# Altium schematic sheet 05_Encoder_IN.SchDoc: -
size A4; Date: -; ApprovedBy: -; CheckedBy: -; Author: -; CompanyName: -; DrawnBy: -; Engineer: -; Organization: Komax AG; Address1: -; Address2: -; Address3: -; Address4: -; DocumentNumber: -; Revision: -; SheetNumber: 5; SheetTotal: 8; KSDP_ObjectName: Encoder IN; KSDP_CreatedBy: Patrick Rossacher; KSDP_CreationDate: 18.12.2017; KSDP_ModificationDate: -; KSDP_ModifiedBy: -; CurrentTime: -; CurrentDate: -; Time: -; DocumentFullPathAndName: -; DocumentName: -; ModifiedDate: -; ImagePath: -
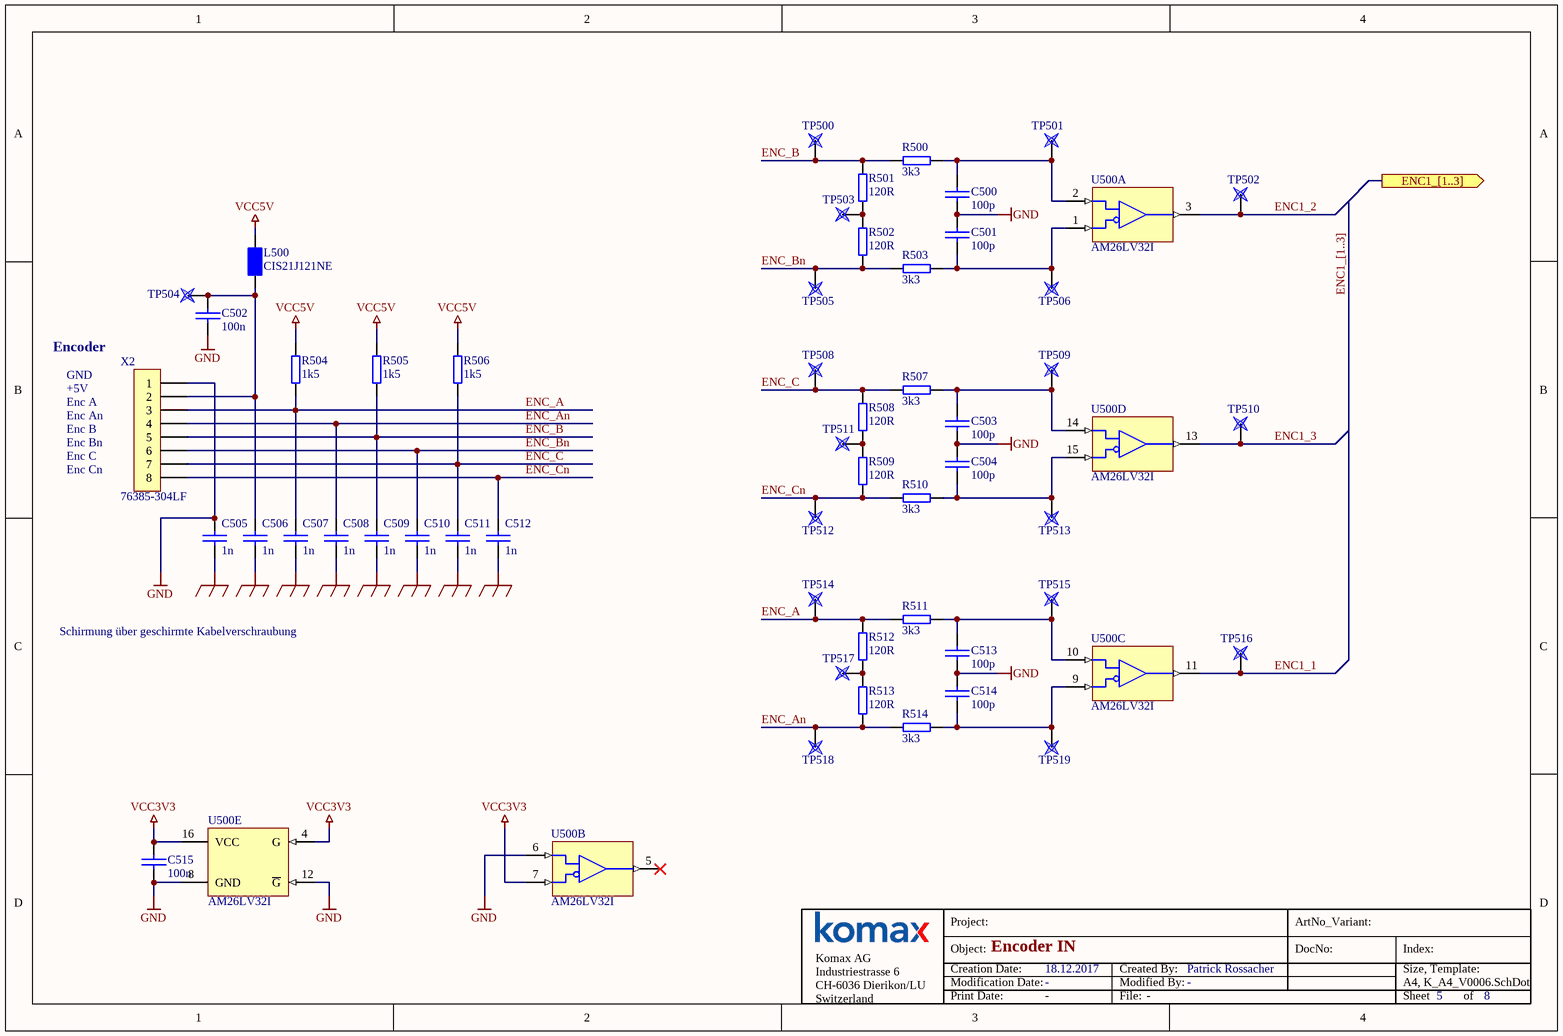
[diagram p0: 05_Encoder_IN.SchDoc]

## Parts
C500  100p  [0402_c]
C501  100p  [0402_c]
C502  100n  [0402_c]
C503  100p  [0402_c]
C504  100p  [0402_c]
C505  1n  [0402_c]
C506  1n  [0402_c]
C507  1n  [0402_c]
C508  1n  [0402_c]
C509  1n  [0402_c]
C510  1n  [0402_c]
C511  1n  [0402_c]
C512  1n  [0402_c]
C513  100p  [0402_c]
C514  100p  [0402_c]
C515  100n  [0402_c]
L500  CIS21J121NE  [0805_R]
R500  3k3  [0402_R]
R501  120R  [0603_R]
R502  120R  [0603_R]
R503  3k3  [0402_R]
R504  1k5  [0402_R]
R505  1k5  [0402_R]
R506  1k5  [0402_R]
R507  3k3  [0402_R]
R508  120R  [0603_R]
R509  120R  [0603_R]
R510  3k3  [0402_R]
R511  3k3  [0402_R]
R512  120R  [0603_R]
R513  120R  [0603_R]
R514  3k3  [0402_R]
TP500  TESTPUNKT  [TP1.5MM]  (value not drawn)  (no BOM)
TP501  TESTPUNKT  [TP1.5MM]  (value not drawn)  (no BOM)
TP502  TESTPUNKT  [TP1.5MM]  (value not drawn)  (no BOM)
TP503  TESTPUNKT  [TP1.5MM]  (value not drawn)  (no BOM)
TP504  TESTPUNKT  [TP1.5MM]  (value not drawn)  (no BOM)
TP505  TESTPUNKT  [TP1.5MM]  (value not drawn)  (no BOM)
TP506  TESTPUNKT  [TP1.5MM]  (value not drawn)  (no BOM)
TP508  TESTPUNKT  [TP1.5MM]  (value not drawn)  (no BOM)
TP509  TESTPUNKT  [TP1.5MM]  (value not drawn)  (no BOM)
TP510  TESTPUNKT  [TP1.5MM]  (value not drawn)  (no BOM)
TP511  TESTPUNKT  [TP1.5MM]  (value not drawn)  (no BOM)
TP512  TESTPUNKT  [TP1.5MM]  (value not drawn)  (no BOM)
TP513  TESTPUNKT  [TP1.5MM]  (value not drawn)  (no BOM)
TP514  TESTPUNKT  [TP1.5MM]  (value not drawn)  (no BOM)
TP515  TESTPUNKT  [TP1.5MM]  (value not drawn)  (no BOM)
TP516  TESTPUNKT  [TP1.5MM]  (value not drawn)  (no BOM)
TP517  TESTPUNKT  [TP1.5MM]  (value not drawn)  (no BOM)
TP518  TESTPUNKT  [TP1.5MM]  (value not drawn)  (no BOM)
TP519  TESTPUNKT  [TP1.5MM]  (value not drawn)  (no BOM)
U500  AM26LV32I  [SOIC-16]  (parts A,B,C,D,E of 5)
X2  76385-304LF  [CON_THT_FCI_76_385-304-LF]

## Ports
ENC1_[1..3] (out)

## Nets
GND: C500.2 C501.2 C502.1 C503.2 C504.2 C505.1 C513.2 C514.2 C515.2 U500.6(A2) U500.8(GND) U500.12(~{G}) X2.1
Shield_2: C505.2 C506.2 C507.2 C508.2 C509.2 C510.2 C511.2 C512.2
VCC3V3: C515.1 U500.4(G) U500.7(B2) U500.16(VCC)
VCC5V: L500.1 R504.1 R505.2 R506.2
ENC1_1: TP516.1 U500.11(Y3)
ENC1_2: TP502.1 U500.3(Y1)
ENC1_3: TP510.1 U500.13(Y4)
ENC_A: C507.1 R504.2 R511.2 R512.1 TP514.1 X2.3
ENC_An: C508.1 R513.2 R514.2 TP518.1 X2.4
ENC_B: C509.1 R500.2 R501.1 R505.1 TP500.1 X2.5
ENC_Bn: C510.1 R502.2 R503.2 TP505.1 X2.6
ENC_C: C511.1 R506.1 R507.2 R508.1 TP508.1 X2.7
ENC_Cn: C512.1 R509.2 R510.2 TP512.1 X2.8
NetC500_1: C500.1 R500.1 TP501.1 U500.2(A1)
NetC501_1: C501.1 R503.1 TP506.1 U500.1(B1)
NetC502_2: C502.2 C506.1 L500.2 TP504.1 X2.2
NetC503_1: C503.1 R507.1 TP509.1 U500.14(A4)
NetC504_1: C504.1 R510.1 TP513.1 U500.15(B4)
NetC513_1: C513.1 R511.1 TP515.1 U500.10(A3)
NetC514_1: C514.1 R514.1 TP519.1 U500.9(B3)
NetR501_2: R501.2 R502.1 TP503.1
NetR508_2: R508.2 R509.1 TP511.1
NetR512_2: R512.2 R513.1 TP517.1

Not connected (* = marked no-connect by the designer): U500 5(Y2)*

## Buses and harness runs
bus ENC1_[1..3] = port ENC1_[1..3]

## Notes on the sheet
- Encoder
- GND
- +5V
- Enc A
- Enc An
- Enc B
- Enc Bn
- Enc C
- Enc Cn
- Schirmung über geschirmte Kabelverschraubung
- Project:
- ArtNo_Variant:
- Object:
- Creation Date:
- Modification Date:
- Created By:
- Modified By:
- DocNo:
- Index:
- Size, Template:
- A4, K_A4_V0006.SchDot
- Komax AG
  Industriestrasse 6
  CH-6036 Dierikon/LU
  Switzerland
- Print Date:
- File:
- Sheet
- of

## Library data of the parts
C500-C515 = CAP: Ceramic Capacitor >=50V X7R; FootprintBOM: 0402
L500 = INDUCTOR1: Power Supression Bead 120Ohm bei 100MHz 5A; Manufacturer: Samsung; FootprintBOM: 0805
R500 R503-R507 R510 R511 R514 = RES2: Resistor 0.063W 1%; FootprintBOM: 0402
R501 R502 R508 R509 R512 R513 = RES2: Resistor 0.1W 1%; FootprintBOM: 0603
TP500-TP506 TP508-TP519 = P_PRUEFPAD: Testpoint; FootprintBOM: -
U500 = MAX3096CSE: 3.3V 4fach RS422 Receiver +-15kV ESD-Protected; Manufacturer: TI; 2ndSourcesReleased: ISL32173EFBZ; FootprintBOM: SOIC-16
X2 = CON8: Header 2x4p 180° RM=2.54mm; Manufacturer: Amphenol IIC; FootprintBOM: THT